# EAGLE schematic Teclas (EAGLE 6.5.0)
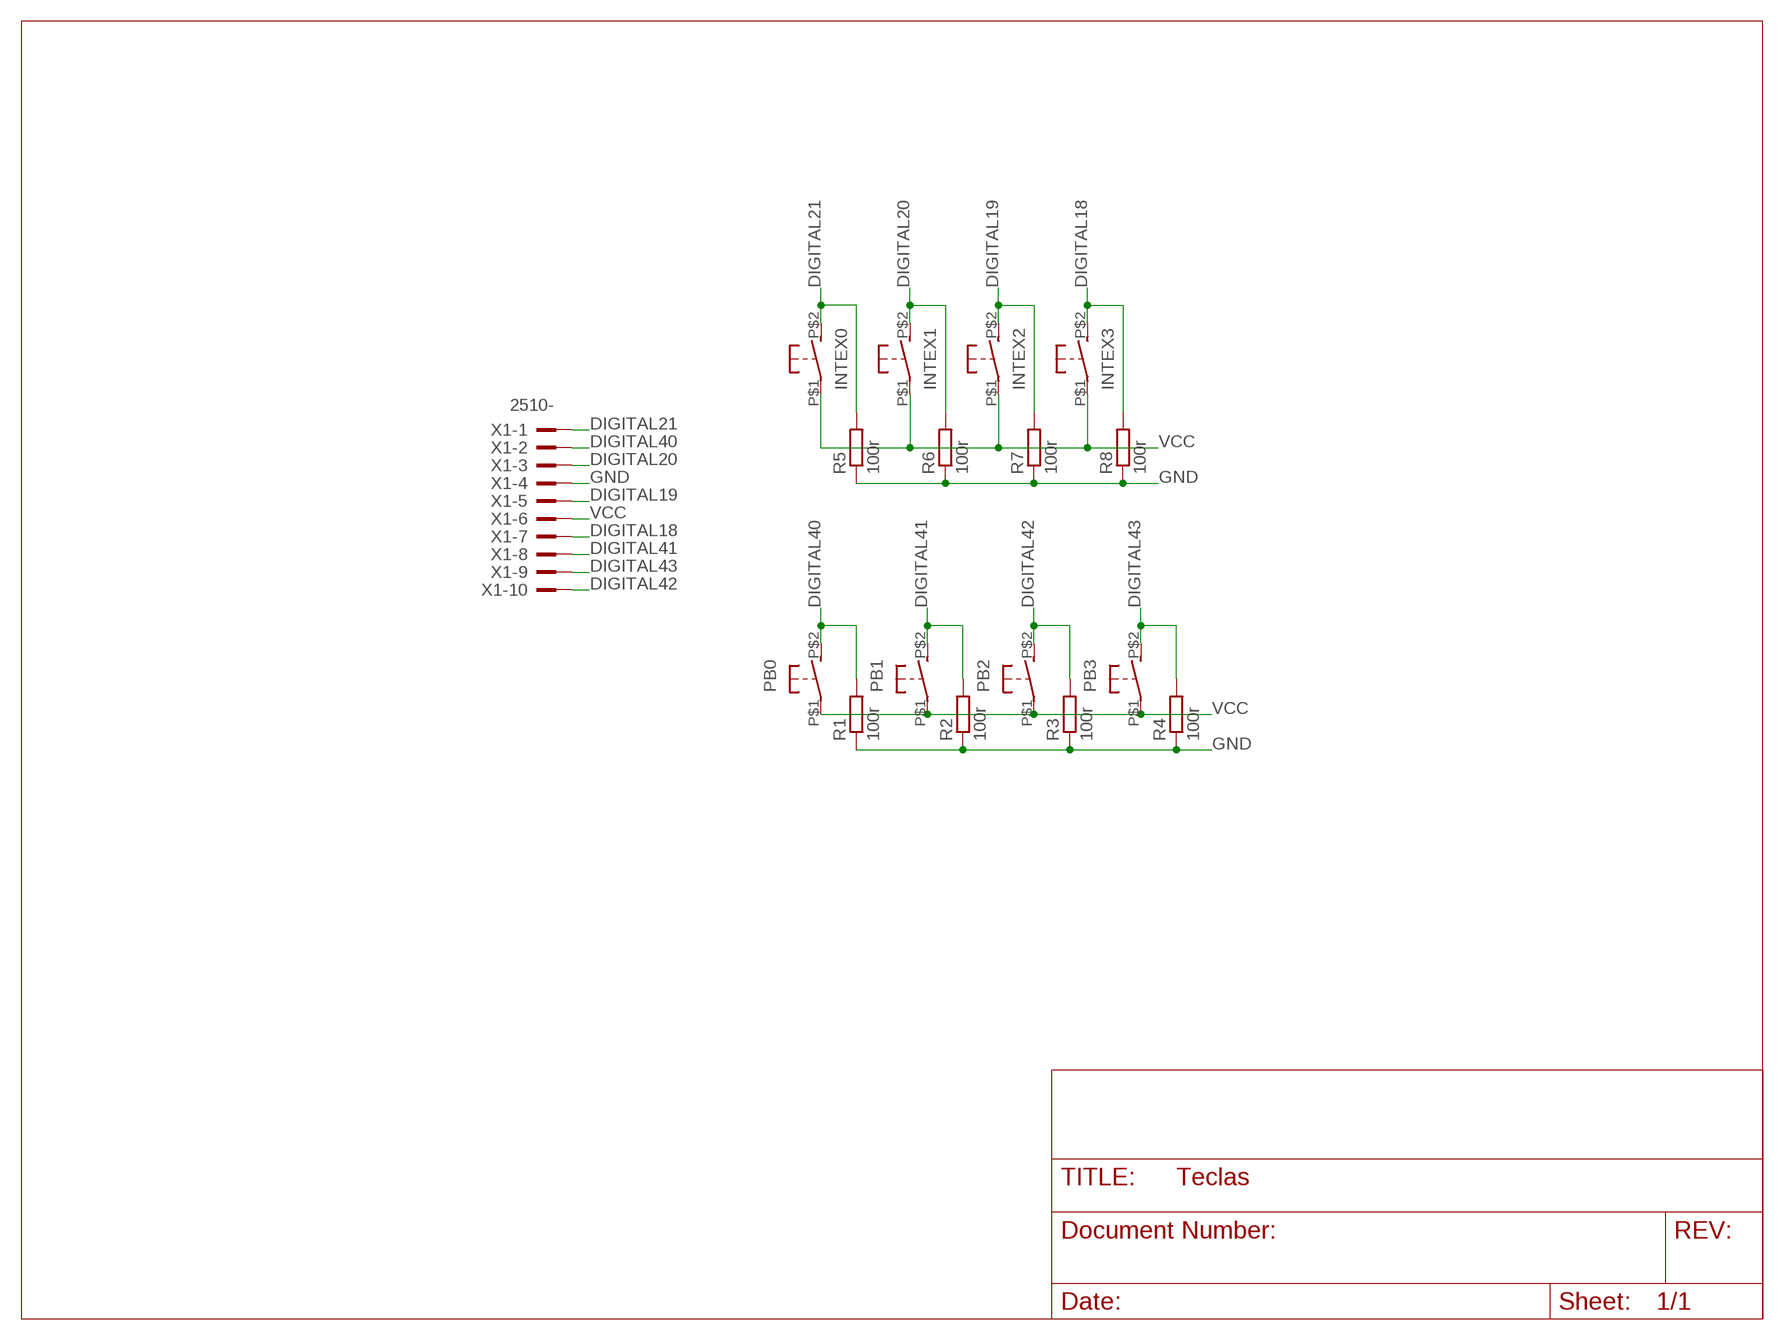
[diagram p0: schematic, sheet 1]

## Parts
INTEX0  DS-451  [DS-451]
INTEX1  DS-451  [DS-451]
INTEX2  DS-451  [DS-451]
INTEX3  DS-451  [DS-451]
PB0  DS-451  [DS-451]
PB1  DS-451  [DS-451]
PB2  DS-451  [DS-451]
PB3  DS-451  [DS-451]
R1  100r  R-EU_  [0204/ELVYS]
R2  100r  R-EU_  [0204/ELVYS]
R3  100r  R-EU_  [0204/ELVYS]
R4  100r  R-EU_  [0204/ELVYS]
R5  100r  R-EU_  [0204/ELVYS]
R6  100r  R-EU_  [0204/ELVYS]
R7  100r  R-EU_  [0204/ELVYS]
R8  100r  R-EU_  [0204/ELVYS]
X1  2510-  [PAK100/2500-10]

## Nets
DIGITAL18: INTEX3.P$2(S) R8.P$2 X1.7
DIGITAL19: INTEX2.P$2(S) R7.P$2 X1.5
DIGITAL20: INTEX1.P$2(S) R6.P$2 X1.3
DIGITAL21: INTEX0.P$2(S) R5.P$2 X1.1
DIGITAL40: PB0.P$2(S) R1.P$2 X1.2
DIGITAL41: PB1.P$2(S) R2.P$2 X1.8
DIGITAL42: PB2.P$2(S) R3.P$2 X1.10
DIGITAL43: PB3.P$2(S) R4.P$2 X1.9
GND: R1.P$1 R2.P$1 R3.P$1 R4.P$1 R5.P$1 R6.P$1 R7.P$1 R8.P$1 X1.4
VCC: INTEX0.P$1(P) INTEX1.P$1(P) INTEX2.P$1(P) INTEX3.P$1(P) PB0.P$1(P) PB1.P$1(P) PB2.P$1(P) PB3.P$1(P) X1.6

## Library data of the parts
INTEX0 INTEX1-INTEX3 PB0 PB1-PB3 = switch-omron:DS-451
R1-R8 = rcl:R-EU_: RESISTOR, European symbol
X1 = con-3m:2510-: 3M (TM) Pak 100 4-Wall Header Source: 3M; MF: 3M; MPN: 2510-6002UB; OC_FARNELL: 9838244; OC_NEWARK: 46F4725